# Altium schematic sheet POWERSYSTEM.SchDoc: DARKYDEN_POWERSYSTEM (part 3 of 3)
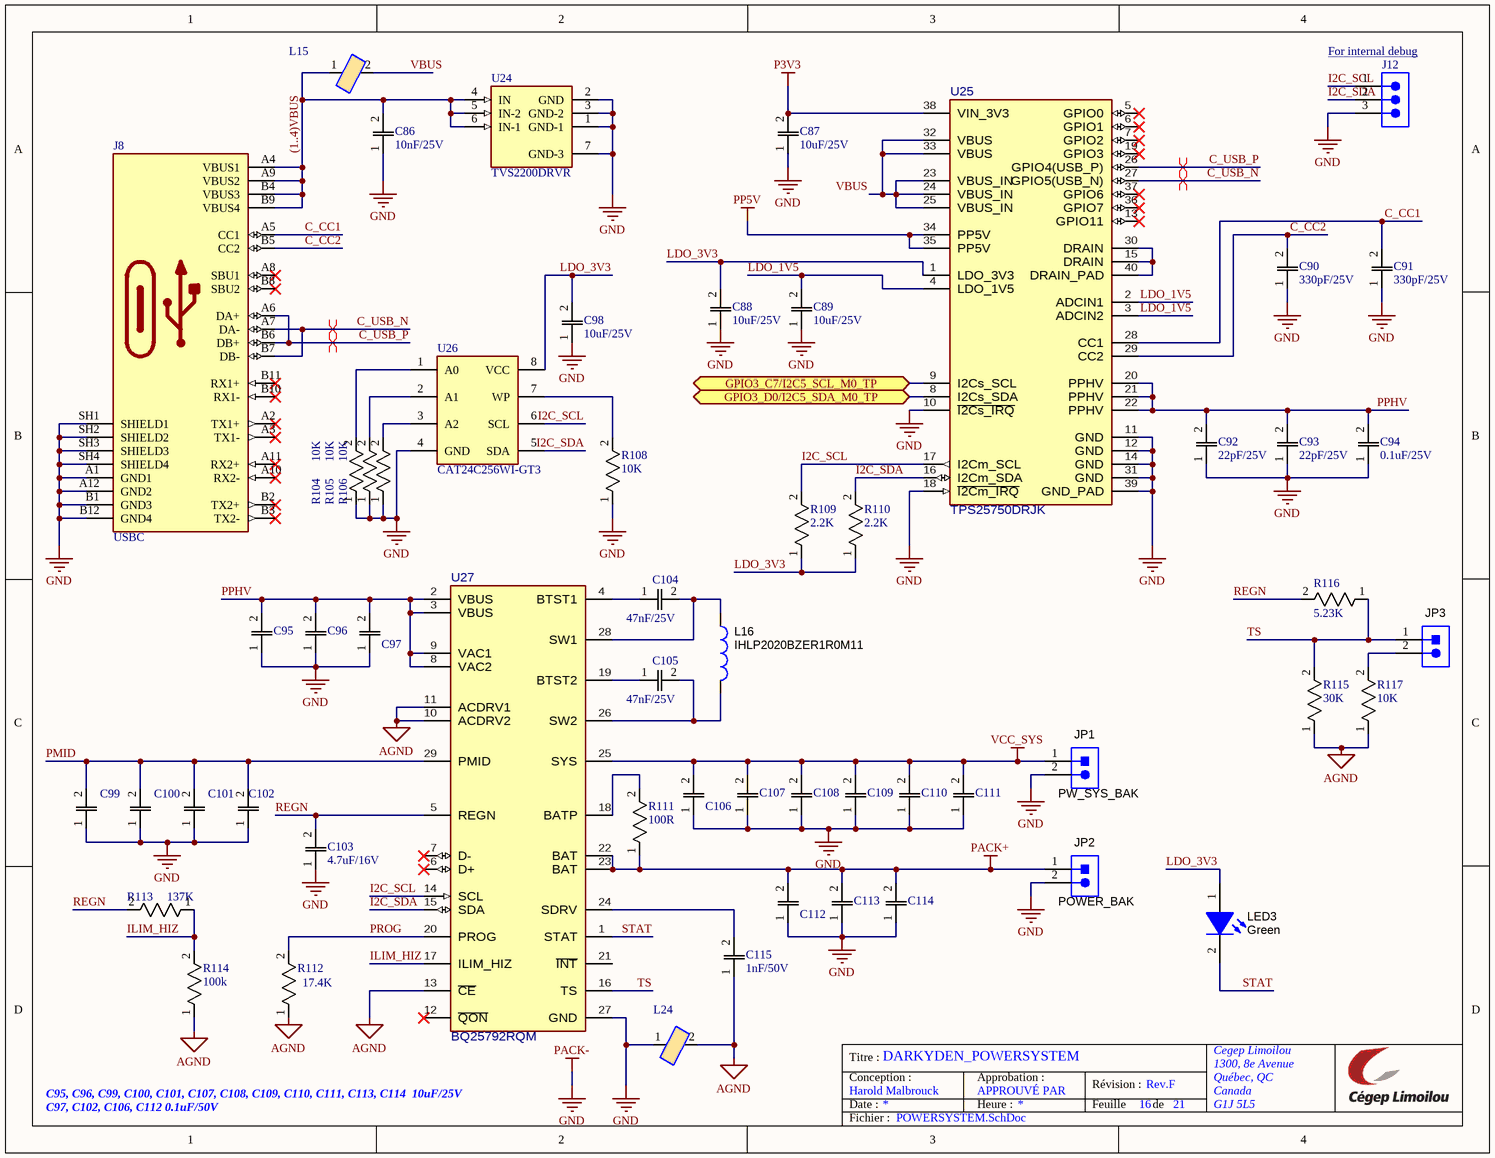
[diagram p2: POWERSYSTEM.SchDoc]

## Library data of the parts (continued)
R116 = ERJ-3EKF5231V: 5.23K Ohm 1% 1/10W Res Thick Film 0603+/-100ppm/ßC Molded SMD Punched Carrier T/R; Manufacturer_Name: Panasonic; Value: 5.23kR; Voltage Rating: 75V; Power Rating: 100mW; Temperature Coefficient: 100ppm/°C; Voltage Rating (DC): 50V; Datasheet Link: http://industrial.panasonic.com/cdbs/www-data/pdf/RDA0000/AOA0000C86.pdf; Height: 0.55mm; Mouser Part Number: 667-ERJ-3EKF5231V; Mouser Price/Stock: https://www.mouser.co.uk/ProductDetail/Panasonic/ERJ-3EKF5231V?qs=LRVwtJ3DVIAOCclJH%2FYgYQ%3D%3D; Arrow Part Number: ERJ-3EKF5231V; Arrow Price/Stock: https://www.arrow.com/en/products/erj-3ekf5231v/panasonic; Supplier: Digikey; Supplier Part Number: P5.23KHCT-ND; Manufacturer: Panasonic; Manufacturer Part Number: ERJ-3EKF5231V; RoHS: Yes; Category: Chip SMD Resistors; Stock: 72624; Pricing: 1=0.1, 10=0.035, 100=0.0177, 1000=0.01014, 2500=0.00847 (USD); Mounting Technology: Surface Mount; Case/Package: 0603; Case Code (Metric): 1608; Case Code (Imperial): 0603; Contact Plating: Tin; Min Operating Temperature: -55°C; Max Operating Temperature: 155°C; Tolerance: 1%; Packaging: Tape and Reel; Package Quantity: 1; Resistor Type: Thick Film; Number of Terminations: 2; Termination: SMD/SMT; Max Power Dissipation: 100mW; Features: Automotive AEC-Q200; Series: ERJ; Resistance Tolerance: 1%; Construction: Rectangular; Length: 1.6mm; Width: 0.8mm; Depth: 0.8mm; Radiation Hardening: No; Reach SVHC Compliant: No; Military Standard: Not; Lead Free: Lead Free; RoHS Compliant: Yes; ComponentLink1URL: https://datasheet.ciiva.com/5972/426256-5972876.pdf?src-supplier=Farnell; ComponentLink1Description: https://datasheet.ciiva.com/5972/426256-5972876.pdf?src-supplier=Farnell; ComponentLink2URL: https://datasheet.ciiva.com/43460/426256-43460517.pdf?src-supplier=Farnell; ComponentLink2Description: https://datasheet.ciiva.com/43460/426256-43460517.pdf?src-supplier=Farnell; ComponentLink3URL: https://datasheet.ciiva.com/9117/aoa0000ce2-9117166.pdf?src-supplier=Avnet; ComponentLink3Description: https://datasheet.ciiva.com/9117/aoa0000ce2-9117166.pdf?src-supplier=Avnet; ComponentLink4URL: https://datasheet.ciiva.com/28685/1678782-28685340.pdf?src-supplier=Element14; ComponentLink4Description: https://datasheet.ciiva.com/28685/1678782-28685340.pdf?src-supplier=Element14; ComponentLink5URL: https://datasheet.ciiva.com/46389/426256-46389320.pdf?src-supplier=Element14; ComponentLink5Description: https://datasheet.ciiva.com/46389/426256-46389320.pdf?src-supplier=Element14; ComponentLink6URL: https://datasheet.ciiva.com/24027/aoa0000ce2-24027445.pdf?src-supplier=Mouser; ComponentLink6Description: https://datasheet.ciiva.com/24027/aoa0000ce2-24027445.pdf?src-supplier=Mouser; ComponentLink7URL: https://datasheet.ciiva.com/16788/70260748-16788534.pdf?src-supplier=Allied+Electronics; ComponentLink7Description: https://datasheet.ciiva.com/16788/70260748-16788534.pdf?src-supplier=Allied+Electronics; ComponentLink8URL: https://datasheet.ciiva.com/16763/70260748-16763706.pdf?src-supplier=Allied+Electronics; ComponentLink8Description: https://datasheet.ciiva.com/16763/70260748-16763706.pdf?src-supplier=Allied+Electronics
U24 = TVS2200DRVR: ESD Suppressors / TVS Diodes 22V flat-clamp surge protection device 6-WSON -40 to 125; MF: Texas Instruments; Number of Channels: 1; Direction: Unidirectional; Breakdown Voltage: 24.6V; Peak Pulse Current: 40A; SnapEDA_Link: https://www.snapeda.com/parts/TVS2200DRVR/Texas+Instruments/view-part/?ref=snap; Package: WSON-6 Texas Instruments; Value: *; MP: TVS2200DRVR; Supplier: Digikey; Supplier Part Number: 296-52187-1-ND; Manufacturer: Texas Instruments; Manufacturer Part Number: TVS2200DRVR; RoHS: Yes; Category: ESD and Circuit Protection ICs; Stock: 5934; Pricing: 1=0.54, 10=0.373, 100=0.254, 500=0.199, 1000=0.181 (USD); Mounting Technology: Surface Mount; Pins: 6; Min Operating Temperature: -40°C; Max Operating Temperature: 125°C; Packaging: Cut Tape; Number of Circuits: 1; Series: -; Reverse Standoff Voltage: 22V; Length: 2mm; Width: 2mm; Height: 800um; Thickness: 750um; RoHS Compliant: Yes; ComponentLink1URL: http://www.ti.com/general/docs/suppproductinfo.tsp?distId=10&amp;gotoUrl=http%3A%2F%2Fwww.ti.com%2Flit%2Fgpn%2Ftvs2200&src-supplier=Digikey; ComponentLink1Description: http://www.ti.com/general/docs/suppproductinfo.tsp?distId=10&amp;gotoUrl=http%3A%2F%2Fwww.ti.com%2Flit%2Fgpn%2Ftvs2200&src-supplier=Digikey; ComponentLink2URL: http://www.ti.com/lit/ds/symlink/tvs2200.pdf?src-supplier=Digikey; ComponentLink2Description: http://www.ti.com/lit/ds/symlink/tvs2200.pdf?src-supplier=Digikey
U25 = TPS25750DRJK: USB Type-C and USB PD Controller with Integrated Power Switches Optimized for Power Applications; Manufacturer: Texas Instruments; CompType: IC; Usb Standard: USB 3.0; AEC Category: Q200; SizeZ_mm: 0.8mm; Standoff Height: 0mm; AEC Qualified: No; Max Supply Voltage: 22V; TaMax_C: +105°C; Min Supply Voltage: 3V; TaMin_C: -40°C; TJmax_C: +175°C; Number Of Ports: 1; RoHS: UNKNOWN; Part Number: TPS25750DRJK; ComponentLink3URL: http://www.ti.com/product/GPN/datasheet; helpURL: https://upverter.com/upn/revision/5be88369cac593dc/; ComponentLink1URL: http://www.ti.com/lit/ds/symlink/GPN.pdf; PackageReference: VQFN32; ComponentLink1Description: Datasheet Link; ComponentLink2URL: http://www.ti.com/product/GPN; Operating Temperature Range: -40°C to +125°C; Datasheet Path: datasheets/IC-TPS25750DRJK.pdf; ComponentLink2Description: Product Folder; ComponentLink3Description: Online Datasheet; Manufacturer Part Number: TPS25750DRJK
U26 = CAT24C256WI-GT3: EEPROM Memory IC 256Kbit I2C 1 MHz 500 ns 8-SOIC; Manufacturer_Name: onsemi; Datasheet Link: https://www.onsemi.com/pub/Collateral/CAT24C256-D.PDF; Height: 1.75mm; Mouser Part Number: 698-CAT24C256WI-GT3; Mouser Price/Stock: https://www.mouser.co.uk/ProductDetail/onsemi/CAT24C256WI-GT3?qs=rZgeL6XvLwaEqwp5Dppodg%3D%3D; Arrow Part Number: CAT24C256WI-GT3; Arrow Price/Stock: https://www.arrow.com/en/products/cat24c256wi-gt3/on-semiconductor?utm_currency=USD&region=nac; Manufacturer Part Number: CAT24C256WI-GT3
U27 = BQ2579x: BQ2579x HotRod; Manufacturer: Texas Instruments; SizeZ_mm: 1mm; Standoff Height: 0mm; helpURL: https://upverter.com/upn/revision/94d0648e55e6c5c0/; Operating Temperature Range: to; Part Number: BQ25792RQM; Datasheet Path: datasheets/IC-BQ25792RQM.pdf; PackageReference: VQFN-HR29; RoHS: UNKNOWN; Manufacturer Part Number: BQ25792RQM